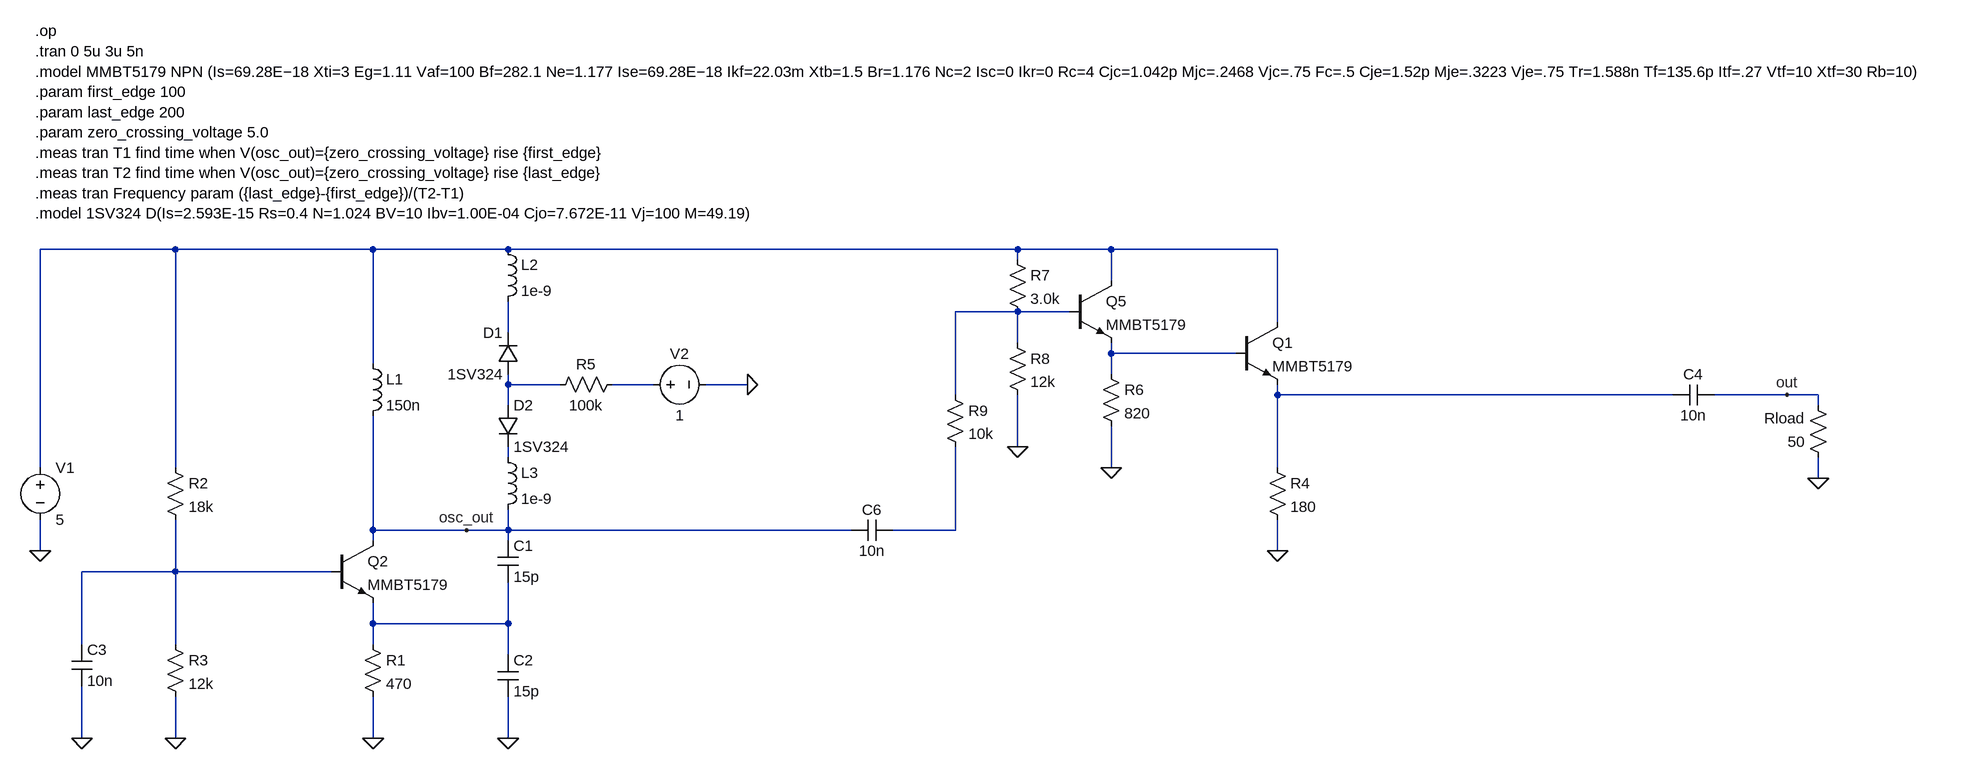
[diagram p0: schematic CB_Colpitts.asc]
CB_Colpitts.asc, the LTspice schematic file:
Version 4
SHEET 1 3292 1348
WIRE 256 -192 48 -192
WIRE 560 -192 256 -192
WIRE 768 -192 560 -192
WIRE 1552 -192 768 -192
WIRE 1696 -192 1552 -192
WIRE 1952 -192 1696 -192
WIRE 1552 -176 1552 -192
WIRE 1696 -144 1696 -192
WIRE 1552 -96 1456 -96
WIRE 1632 -96 1552 -96
WIRE 1952 -80 1952 -192
WIRE 768 -64 768 -112
WIRE 1552 -48 1552 -96
WIRE 1696 -32 1696 -48
WIRE 1888 -32 1696 -32
WIRE 560 -16 560 -192
WIRE 1696 0 1696 -32
WIRE 768 16 768 0
WIRE 848 16 768 16
WIRE 992 16 928 16
WIRE 1136 16 1072 16
WIRE 1456 32 1456 -96
WIRE 1952 32 1952 16
WIRE 2560 32 1952 32
WIRE 2736 32 2624 32
WIRE 2784 32 2736 32
WIRE 768 48 768 16
WIRE 2784 48 2784 32
WIRE 1552 112 1552 32
WIRE 768 128 768 112
WIRE 48 144 48 -192
WIRE 256 144 256 -192
WIRE 1696 144 1696 80
WIRE 1952 144 1952 32
WIRE 2784 160 2784 128
WIRE 560 240 560 64
WIRE 704 240 560 240
WIRE 768 240 768 208
WIRE 768 240 704 240
WIRE 1296 240 768 240
WIRE 1456 240 1456 112
WIRE 1456 240 1360 240
WIRE 560 256 560 240
WIRE 768 256 768 240
WIRE 48 272 48 224
WIRE 1952 272 1952 224
WIRE 256 304 256 224
WIRE 256 304 112 304
WIRE 496 304 256 304
WIRE 560 384 560 352
WIRE 768 384 768 320
WIRE 768 384 560 384
WIRE 112 416 112 304
WIRE 256 416 256 304
WIRE 560 416 560 384
WIRE 768 432 768 384
WIRE 112 560 112 480
WIRE 256 560 256 496
WIRE 560 560 560 496
WIRE 768 560 768 496
FLAG 48 272 0
FLAG 256 560 0
FLAG 560 560 0
FLAG 768 560 0
FLAG 112 560 0
FLAG 704 240 osc_out
FLAG 1136 16 0
FLAG 2784 160 0
FLAG 2736 32 out
FLAG 1696 144 0
FLAG 1552 112 0
FLAG 1952 272 0
DATAFLAG 352 304 ""
DATAFLAG 656 384 ""
DATAFLAG 2064 32 ""
DATAFLAG 1808 -32 ""
SYMBOL npn 496 256 R0
SYMATTR InstName Q2
SYMATTR Value MMBT5179
SYMBOL res 544 400 R0
SYMATTR InstName R1
SYMATTR Value 470
SYMBOL res 240 128 R0
SYMATTR InstName R2
SYMATTR Value 18k
SYMBOL res 240 400 R0
SYMATTR InstName R3
SYMATTR Value 12k
SYMBOL voltage 48 128 R0
SYMATTR InstName V1
SYMATTR Value 5
SYMBOL ind 544 -32 R0
SYMATTR InstName L1
SYMATTR Value 150n
SYMATTR SpiceLine Rser=0.01
SYMBOL cap 752 256 R0
SYMATTR InstName C1
SYMATTR Value 15p
SYMBOL cap 752 432 R0
SYMATTR InstName C2
SYMATTR Value 15p
SYMBOL cap 96 416 R0
SYMATTR InstName C3
SYMATTR Value 10n
SYMBOL res 832 32 R270
WINDOW 0 32 56 VTop 2
WINDOW 3 0 56 VBottom 2
SYMATTR InstName R5
SYMATTR Value 100k
SYMBOL voltage 976 16 R270
WINDOW 0 32 56 VTop 2
WINDOW 3 -32 56 VBottom 2
SYMATTR InstName V2
SYMATTR Value 1
SYMBOL diode 784 0 R180
WINDOW 0 24 64 Left 2
WINDOW 3 24 0 Left 2
SYMATTR InstName D1
SYMATTR Value 1SV324
SYMBOL diode 752 48 R0
SYMATTR InstName D2
SYMATTR Value 1SV324
SYMBOL ind 752 -208 R0
SYMATTR InstName L2
SYMATTR Value 1e-9
SYMBOL ind 752 112 R0
SYMATTR InstName L3
SYMATTR Value 1e-9
SYMBOL cap 1360 224 R90
WINDOW 0 0 32 VBottom 2
WINDOW 3 32 32 VTop 2
SYMATTR InstName C6
SYMATTR Value 10n
SYMBOL npn 1888 -80 R0
SYMATTR InstName Q1
SYMATTR Value MMBT5179
SYMBOL res 2800 144 R180
WINDOW 0 36 76 Left 2
WINDOW 3 36 40 Left 2
SYMATTR InstName Rload
SYMATTR Value 50
SYMBOL cap 2624 16 R90
WINDOW 0 0 32 VBottom 2
WINDOW 3 32 32 VTop 2
SYMATTR InstName C4
SYMATTR Value 10n
SYMBOL npn 1632 -144 R0
SYMATTR InstName Q5
SYMATTR Value MMBT5179
SYMBOL res 1680 -16 R0
SYMATTR InstName R6
SYMATTR Value 820
SYMBOL res 1536 -192 R0
SYMATTR InstName R7
SYMATTR Value 3.0k
SYMBOL res 1536 -64 R0
SYMATTR InstName R8
SYMATTR Value 12k
SYMBOL res 1936 128 R0
SYMATTR InstName R4
SYMATTR Value 180
SYMBOL res 1440 16 R0
SYMATTR InstName R9
SYMATTR Value 10k
TEXT 40 -528 Left 2 !.op\n.tran 0 5u 3u 5n\n.model MMBT5179 NPN (Is=69.28E−18 Xti=3 Eg=1.11 Vaf=100 Bf=282.1 Ne=1.177 Ise=69.28E−18 Ikf=22.03m Xtb=1.5 Br=1.176 Nc=2 Isc=0 Ikr=0 Rc=4 Cjc=1.042p Mjc=.2468 Vjc=.75 Fc=.5 Cje=1.52p Mje=.3223 Vje=.75 Tr=1.588n Tf=135.6p Itf=.27 Vtf=10 Xtf=30 Rb=10)\n.param first_edge 100\n.param last_edge 200\n.param zero_crossing_voltage 5.0\n.meas tran T1 find time when V(osc_out)={zero_crossing_voltage} rise {first_edge}\n.meas tran T2 find time when V(osc_out)={zero_crossing_voltage} rise {last_edge}\n.meas tran Frequency param ({last_edge}-{first_edge})/(T2-T1)\n.model 1SV324 D(Is=2.593E-15 Rs=0.4 N=1.024 BV=10 Ibv=1.00E-04 Cjo=7.672E-11 Vj=100 M=49.19)

The netlist it stands for:
* CB_Colpitts.asc
Q2 osc_out N010 N011 0 MMBT5179
R1 N011 0 470
R2 N001 N010 18k
R3 N010 0 12k
V1 N001 0 5
L1 N001 osc_out 150n Rser=0.01
C1 osc_out N011 15p
C2 N011 0 15p
C3 N010 0 10n
R5 N005 N006 100k
V2 N006 0 1
D1 N005 N003 1SV324
D2 N005 N008 1SV324
L2 N001 N003 1e-9
L3 N008 osc_out 1e-9
C6 N009 osc_out 10n
Q1 N001 N004 N007 0 MMBT5179
Rload 0 out 50
C4 out N007 10n
Q5 N001 N002 N004 0 MMBT5179
R6 N004 0 820
R7 N001 N002 3.0k
R8 N002 0 12k
R4 N007 0 180
R9 N002 N009 10k
.model D D
.lib standard.dio
.model NPN NPN
.model PNP PNP
.lib standard.bjt
.op
.tran 0 5u 3u 5n
.model MMBT5179 NPN (Is=69.28E−18 Xti=3 Eg=1.11 Vaf=100 Bf=282.1 Ne=1.177 Ise=69.28E−18 Ikf=22.03m Xtb=1.5 Br=1.176 Nc=2 Isc=0 Ikr=0 Rc=4 Cjc=1.042p Mjc=.2468 Vjc=.75 Fc=.5 Cje=1.52p Mje=.3223 Vje=.75 Tr=1.588n Tf=135.6p Itf=.27 Vtf=10 Xtf=30 Rb=10)
.param first_edge 100
.param last_edge 200
.param zero_crossing_voltage 5.0
.meas tran T1 find time when V(osc_out)={zero_crossing_voltage} rise {first_edge}
.meas tran T2 find time when V(osc_out)={zero_crossing_voltage} rise {last_edge}
.meas tran Frequency param ({last_edge}-{first_edge})/(T2-T1)
.model 1SV324 D(Is=2.593E-15 Rs=0.4 N=1.024 BV=10 Ibv=1.00E-04 Cjo=7.672E-11 Vj=100 M=49.19)
.backanno
.end